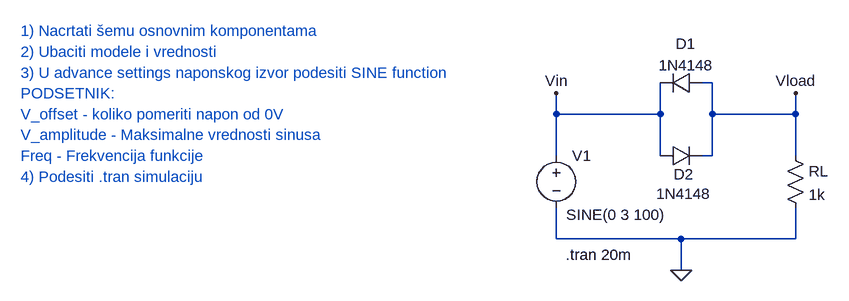
[diagram p0: schematic V2_SINE.asc]
V2_SINE.asc, the LTspice schematic file:
Version 4
SHEET 1 880 680
WIRE 192 -16 176 -16
WIRE -48 32 -48 0
WIRE 112 32 112 -16
WIRE 112 32 -48 32
WIRE 192 32 192 -16
WIRE 320 32 320 0
WIRE 320 32 192 32
WIRE -48 96 -48 32
WIRE 112 96 112 32
WIRE 192 96 192 32
WIRE 192 96 176 96
WIRE 320 96 320 32
WIRE -48 224 -48 176
WIRE 144 224 -48 224
WIRE 320 224 320 176
WIRE 320 224 144 224
WIRE 144 272 144 224
FLAG 144 272 0
FLAG -48 0 Vin
FLAG 320 0 Vload
SYMBOL voltage -48 80 R0
WINDOW 3 15 107 Left 2
WINDOW 123 0 0 Left 0
WINDOW 39 0 0 Left 0
SYMATTR InstName V1
SYMATTR Value SINE(0 3 100)
SYMBOL diode 176 -32 R90
WINDOW 0 -29 25 VBottom 2
WINDOW 3 -27 24 VTop 2
SYMATTR InstName D1
SYMATTR Value 1N4148
SYMBOL diode 112 112 R270
WINDOW 0 -28 36 VTop 2
WINDOW 3 -27 36 VBottom 2
SYMATTR InstName D2
SYMATTR Value 1N4148
SYMBOL res 304 80 R0
SYMATTR InstName RL
SYMATTR Value 1k
TEXT -872 -96 Left 2 ;1) Nacrtati šemu osnovnim komponentama
TEXT -872 -64 Left 2 ;2) Ubaciti modele i vrednosti
TEXT -872 -32 Left 2 ;3) U advance settings naponskog izvor podesiti SINE function
TEXT -872 0 Left 2 ;PODSETNIK:
TEXT -872 32 Left 2 ;V_offset - koliko pomeriti napon od 0V
TEXT -872 64 Left 2 ;V_amplitude - Maksimalne vrednosti sinusa
TEXT -872 96 Left 2 ;Freq - Frekvencija funkcije
TEXT -872 128 Left 2 ;4) Podesiti .tran simulaciju
TEXT -34 248 Left 2 !.tran 20m

The netlist it stands for:
* V2_SINE.asc
V1 Vin 0 SINE(0 3 100)
D1 Vload Vin 1N4148
D2 Vin Vload 1N4148
RL Vload 0 1k
.model D D
.lib standard.dio
* 1) Nacrtati šemu osnovnim komponentama
* 2) Ubaciti modele i vrednosti
* 3) U advance settings naponskog izvor podesiti SINE function
* PODSETNIK:
* V_offset - koliko pomeriti napon od 0V
* V_amplitude - Maksimalne vrednosti sinusa
* Freq - Frekvencija funkcije
* 4) Podesiti .tran simulaciju
.tran 20m
.backanno
.end